# EAGLE design BergProbe (EAGLE 6.5.0)
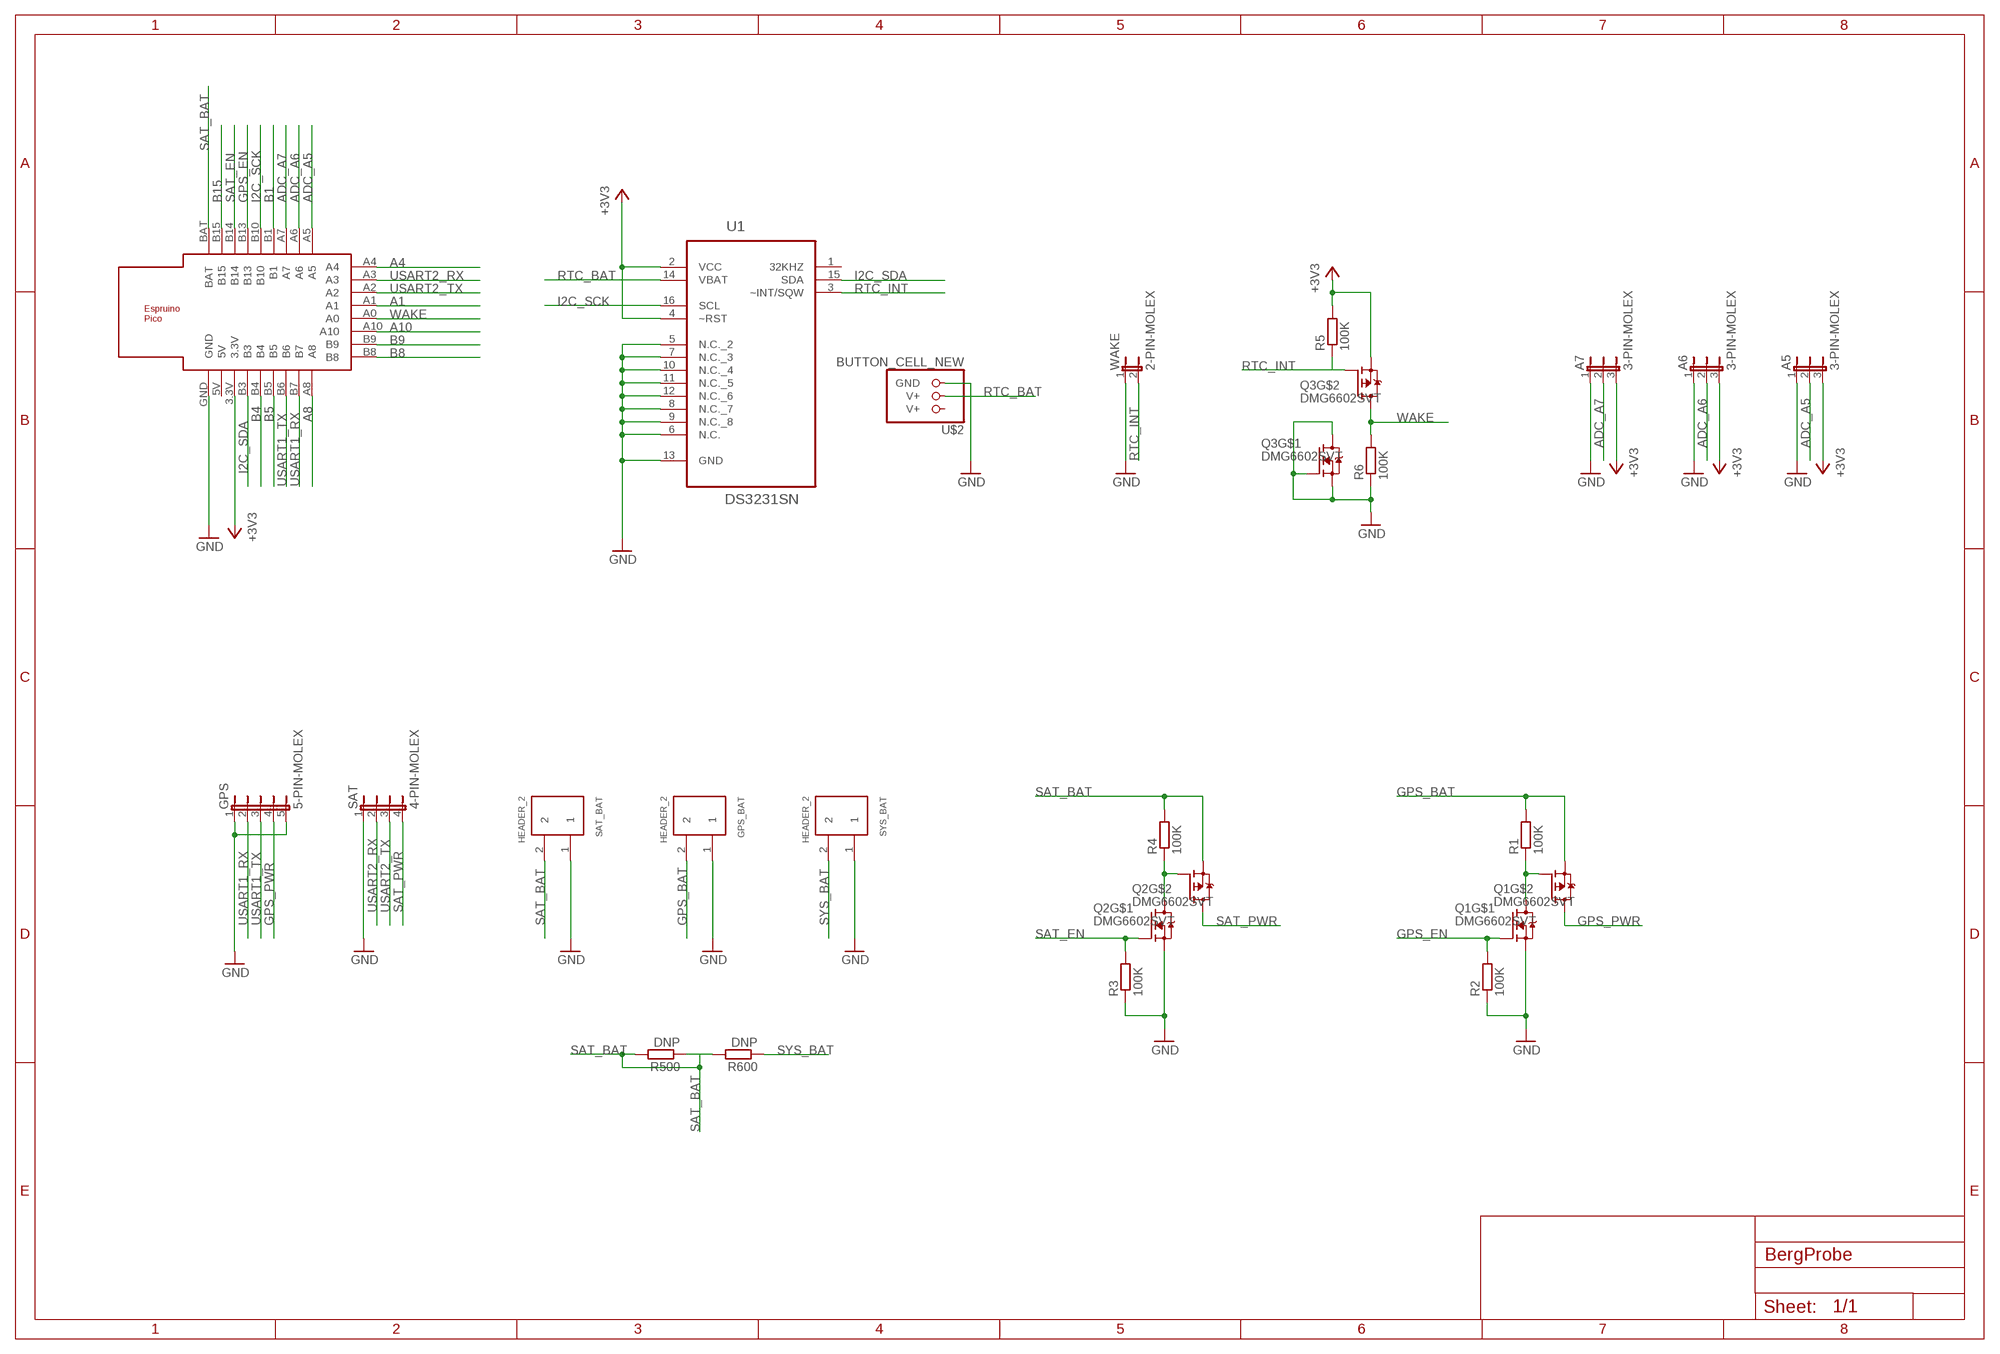
[diagram p0: schematic, sheet 1]

## Parts
A5  3-PIN-MOLEX  [3-MOLEX]
A6  3-PIN-MOLEX  [3-MOLEX]
A7  3-PIN-MOLEX  [3-MOLEX]
GPS  5-PIN-MOLEX  [5-MOLEX]
GPS_BAT  HEADER_2  [LUMBERG_CAGE_2]
Q1  DMG6602SVT  [TSOT26]
Q2  DMG6602SVT  [TSOT26]
Q3  DMG6602SVT  [TSOT26]
R1  100K  R-EU_R0805  [R0805]
R2  100K  R-EU_R0805  [R0805]
R3  100K  R-EU_R0805  [R0805]
R4  100K  R-EU_R0805  [R0805]
R5  100K  R-EU_R0805  [R0805]
R6  100K  R-EU_R0805  [R0805]
R500  DNP  R-EU_R0805  [R0805]
R600  DNP  R-EU_R0805  [R0805]
SAT  4-PIN-MOLEX  [4-MOLEX]
SAT_BAT  HEADER_2  [LUMBERG_CAGE_2]
SYS_BAT  HEADER_2  [LUMBERG_CAGE_2]
U1  DS3231SN  [SOIC127P1032X265-16N]
U$1  ESPRUINO_PICO_SMDONLY  [ESPRUINO_PICO_SMDONLY]
U$2  BUTTON_CELL_NEW  [CR2016]
WAKE  2-PIN-MOLEX  [2-MOLEX]

## Nets
+3V3: A5.3 A6.3 A7.3 Q3.P$2(S) R5.2 U1.2(VCC) U1.4(~RST) U$1.3.3V
A1: U$1.A1
A4: U$1.A4
A8: U$1.A8
A10: U$1.A10
ADC_A5: A5.2 U$1.A5
ADC_A6: A6.2 U$1.A6
ADC_A7: A7.2 U$1.A7
B1: U$1.B1
B4: U$1.B4
B5: U$1.B5
B8: U$1.B8
B9: U$1.B9
B15: U$1.B15
GND: A5.1 A6.1 A7.1 GPS.1 GPS.5 GPS_BAT.1 Q1.P$5(S) Q2.P$5(S) Q3.P$1(G) Q3.P$5(S) Q3.P$6(D) R2.1 R3.1 R6.1 SAT.1 SAT_BAT.1 SYS_BAT.1 U1.5(N.C._2) U1.6(N.C.) U1.7(N.C._3) U1.8(N.C._7) U1.9(N.C._8) U1.10(N.C._4) U1.11(N.C._5) U1.12(N.C._6) U1.13(GND) U$1.GND U$2.GND WAKE.1
GPS_BAT: GPS_BAT.2 Q1.P$2(S) R1.2
GPS_EN: Q1.P$1(G) R2.2 U$1.B13
GPS_PWR: GPS.4 Q1.P$4(D)
I2C_SCK: U1.16(SCL) U$1.B10
I2C_SDA: U1.15(SDA) U$1.B3
N$2: Q1.P$3(G) Q1.P$6(D) R1.1
N$7: Q2.P$3(G) Q2.P$6(D) R4.1
RTC_BAT: U1.14(VBAT) U$2.V+@2(V+)
RTC_INT: Q3.P$3(G) R5.1 U1.3(~INT/SQW) WAKE.2
SAT_BAT: Q2.P$2(S) R4.2 R500.1 R500.2 R600.2 SAT_BAT.2 U$1.BAT
SAT_EN: Q2.P$1(G) R3.2 U$1.B14
SAT_PWR: Q2.P$4(D) SAT.4
SYS_BAT: R600.1 SYS_BAT.2
USART1_RX: GPS.2 U$1.B7
USART1_TX: GPS.3 U$1.B6
USART2_RX: SAT.2 U$1.A3
USART2_TX: SAT.3 U$1.A2
WAKE: Q3.P$4(D) R6.2 U$1.A0
Unconnected: U1.1(32KHZ) U$1.5V U$2.V+@1(V+)

## Library data of the parts
A5-A7 = farnell-parts:3-PIN-MOLEX
GPS = farnell-parts:5-PIN-MOLEX
GPS_BAT SAT_BAT SYS_BAT = gumsense:HEADER_2
Q1-Q3 = farnell-parts:DMG6602SVT
R1-R6 R500 R600 = resistor:R-EU_: RESISTOR, European symbol
SAT = farnell-parts:4-PIN-MOLEX
U1 = farnell-parts:DS3231SN: Extremely Accurate I2C-Integrated RTC/TCXO/Crystal; MPN: DS3231SN#; OC_FARNELL: 1593292; OC_NEWARK: 68K3406; PACKAGE: SOIC-16; SUPPLIER: Maxim
U$1 = espruino_pico:ESPRUINO_PICO_SMDONLY
U$2 = gumsense:BUTTON_CELL_NEW
WAKE = farnell-parts:2-PIN-MOLEX

## Board
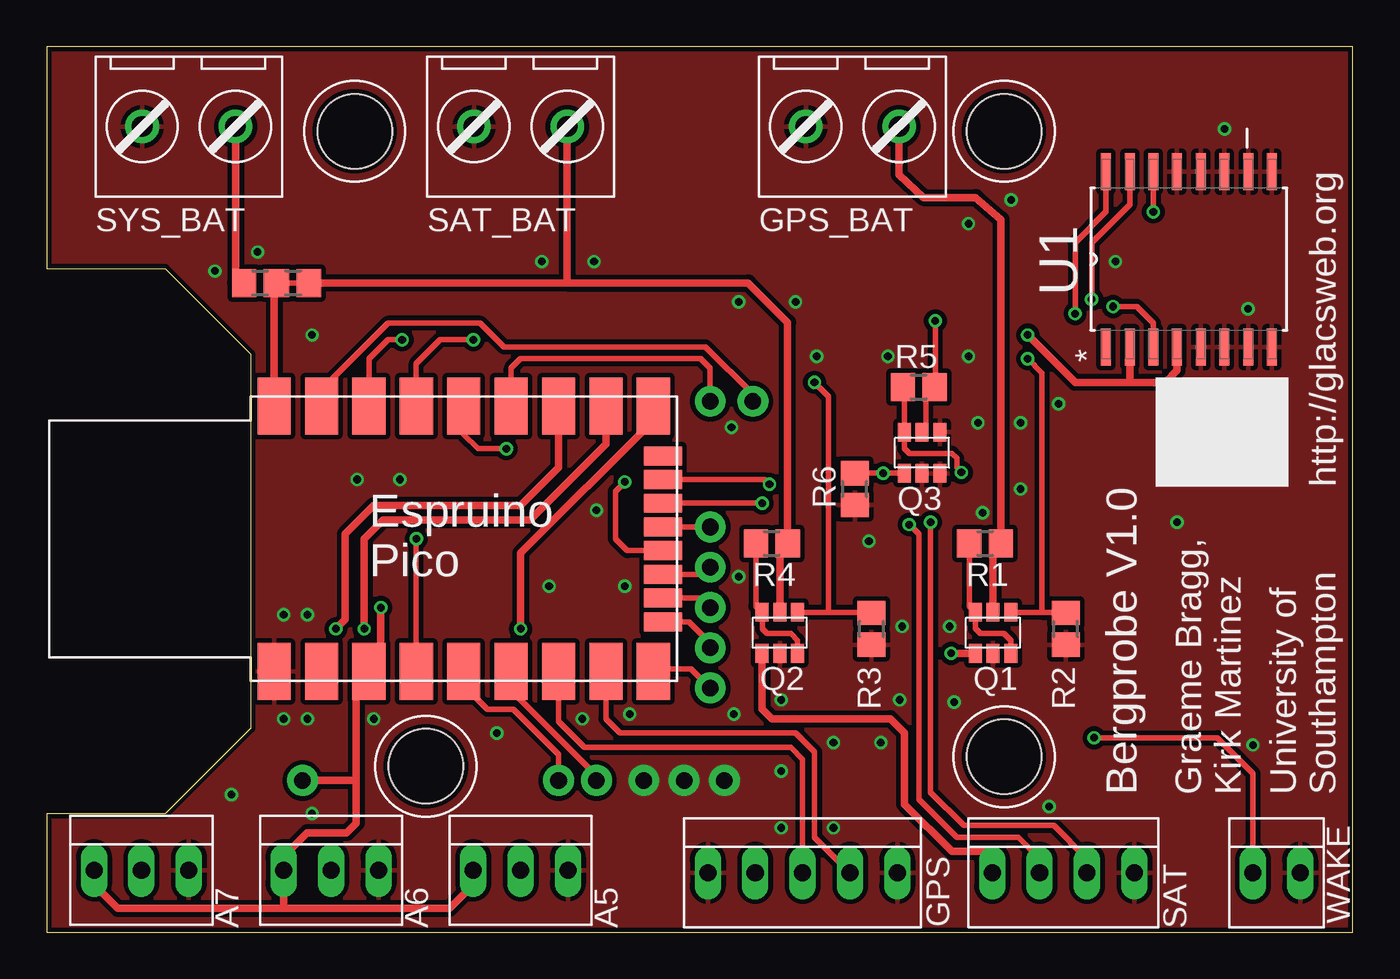
[diagram p1: board, top side]
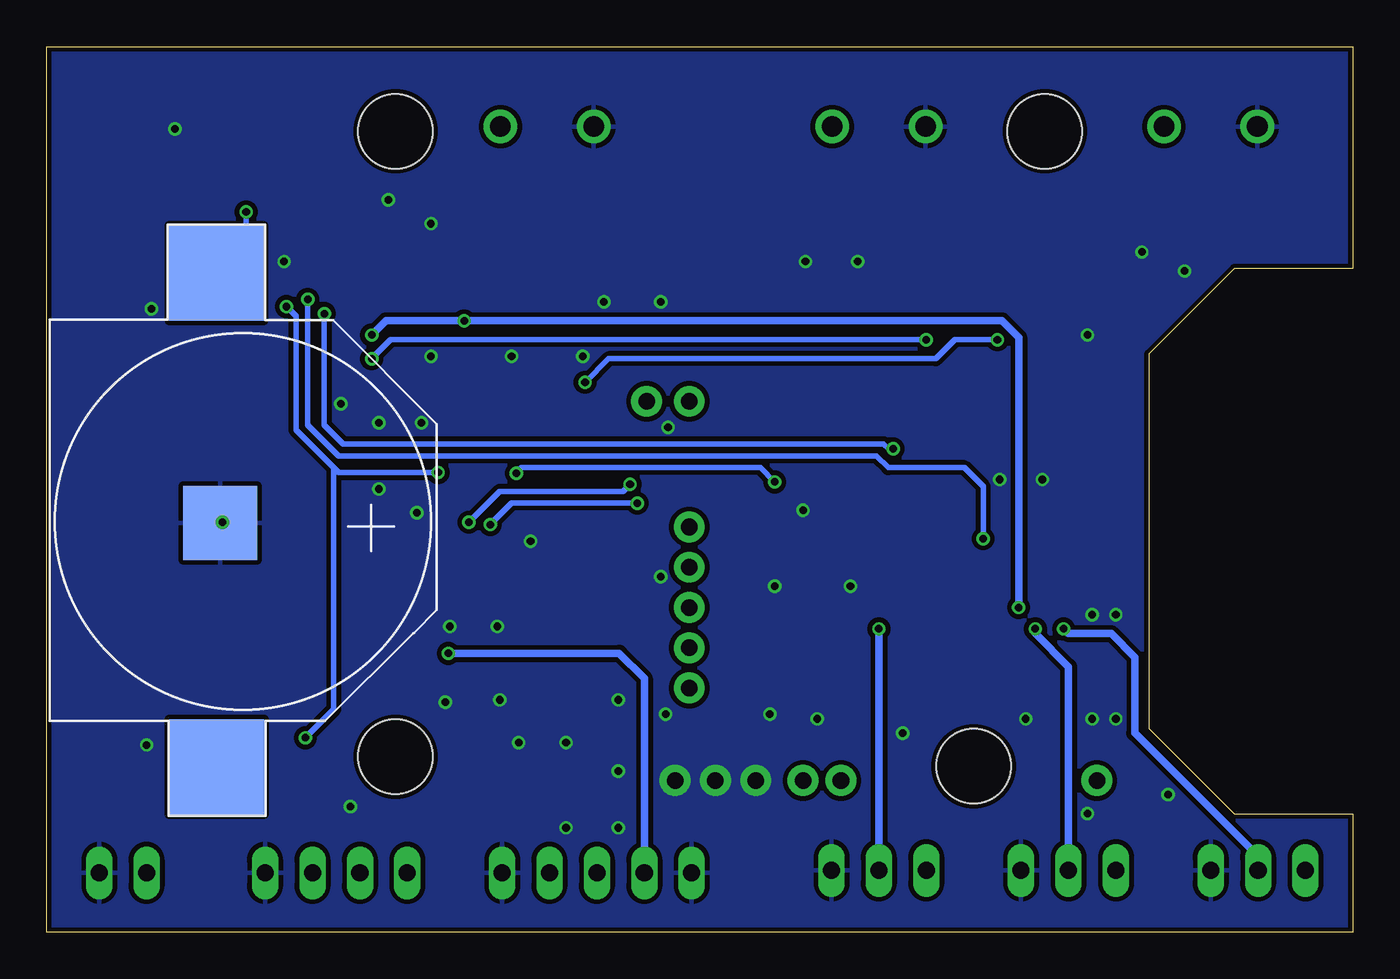
[diagram p2: board, bottom side, seen from below]

Size 70 x 47.46 mm. Coordinates in mm from the lower left corner, seen from the top.
Outline: 0,0 70,0 70,47.46 0,47.46 0,35.56 6.35,35.56 10.92,30.99 10.92,10.92 6.35,6.35 0,6.35 0,0
Copper layers (1*16): Top 0.035mm / dielectric 1.5mm / Bottom 0.035mm
Design rules "dirt_cheap_dirty_boards.v1": minimum track width 5mil, minimum drill 12mil, track to track 5mil, track to pad 5mil, pad to pad 5mil, via to via 5mil, smd to smd 0mil, copper to edge 10mil, drill to drill 10mil, minimum pad ring 10mil, minimum via ring 6mil, stop-mask expansion 2mil, vias tented up to drill 25mil, thermal gap 10mil
Holes 4 mm at 16.51,42.93 20.32,8.89 51.31,9.4 51.31,42.93
vRestrict: area 20.6,15.5 to 24.1,26.7; area 10.9,18.3 to 18.3,23.6; area 10.9,24.9 to 20.3,26.7; area 10.9,15.5 to 14.7,18.3; area 26.4,15.5 to 31.5,17.3; area 24.1,22.9 to 28.4,25.7

### Footprints (pad centres in the part's own frame; a part is rotated, then mirrored left to right if it is on the bottom)
3-MOLEX = drill 0.914 long: 1 -2.54,0; 2 0,0; 3 2.54,0
5-MOLEX = drill 0.914 long: 1 -3.937,-0.127; 2 -1.397,-0.127; 3 1.143,-0.127; 4 3.683,-0.127; 5 6.223,-0.127
LUMBERG_CAGE_2 = drill 1.1 pad 1.8: 1 -2.5,0; 2 2.5,0
TSOT26 = smd 0.7 x 1: P$1 0.4,-1.9; P$2 1.35,-1.9; P$3 2.3,-1.9; P$4 2.3,0.3; P$5 1.35,0.3; P$6 0.4,0.3
R0805 = smd 1.3 x 1.5: 1 -0.85,0; 2 0.85,0
4-MOLEX = drill 0.914 long: 1 -2.667,-0.381; 2 -0.127,-0.381; 3 2.413,-0.381; 4 4.953,-0.381
SOIC127P1032X265-16N = smd 1.981 x 0.533: 1 -4.699,4.445; 2 -4.699,3.175; 3 -4.699,1.905; 4 -4.699,0.635; 5 -4.699,-0.635; 6 -4.699,-1.905; 7 -4.699,-3.175; 8 -4.699,-4.445; 9 4.699,-4.445; 10 4.699,-3.175; 11 4.699,-1.905; 12 4.699,-0.635; 13 4.699,0.635; 14 4.699,1.905; 15 4.699,3.175; 16 4.699,4.445
ESPRUINO_PICO_SMDONLY = smd 1.778 x 3.048: 3.3V -8.89,-7.112; 5V -11.43,-7.112; A5 6.35,7.112; A6 3.81,7.112; A7 1.27,7.112; A8 6.35,-7.112; B1 -1.27,7.112; B3 -6.35,-7.112; B4 -3.81,-7.112; B5 -1.27,-7.112; B6 1.27,-7.112; B7 3.81,-7.112; B10 -3.81,7.112; B13 -6.35,7.112; B14 -8.89,7.112; B15 -11.43,7.112; BAT -13.97,7.112; GND -13.97,-7.112 | smd 2.032 x 1.016: A0 6.858,-0.635; A1 6.858,0.635; A2 6.858,1.905; A3 6.858,3.175; A4 6.858,4.445; A10 6.858,-1.905; B8 6.858,-4.445; B9 6.858,-3.175
CR2016 = smd 3.962 x 3.962: GND -1.7,8.63 | smd 5.08 x 5.08: V+@1 -14.765,8.812; V+@2 11.7,8.83
2-MOLEX = drill 0.914 long: 1 -1.27,-0.381; 2 1.27,-0.381

### Placement (x,y rotation side)
A5  25.4,3.3 180 top
A6  15.24,3.3 180 top
A7  5.08,3.3 180 top
GPS  41.66,3.05 180 top
GPS_BAT  43.18,43.18 0 top
Q1  52.07,15.24 180 top
Q2  40.64,15.24 180 top
Q3  48.26,24.89 180 top
R1  50.29,20.83 0 top
R2  54.61,16.26 90 top
R3  44.2,16.26 90 top
R4  38.86,20.83 0 top
R5  46.74,29.21 0 top
R6  43.31,23.75 90 top
R500  13.21,34.8 0 top
R600  11.43,34.8 0 top
SAT  55.63,2.79 180 top
SAT_BAT  25.4,43.18 0 top
SYS_BAT  7.62,43.18 0 top
U1  61.21,36.07 90 top
U$1  26.16,21.08 0 top
U$2  52.07,23.62 90 bottom
WAKE  65.91,2.79 180 top

### Tracks (layer width: path | path; a pad name or v marks a point on that pad's centre or on a via)
+3V3  (via drill 0.41, 0.89 pad 1.65)
  Top 0.305: Q3.P$2 46.91,26.84 47.12,27.05 47.12,28.74 R5.2 47.62,29.25 v47.62,32.77
  Top 0.406: A7.3 2.54,2.54 3.81,1.27 12.7,1.27 | 12.7,1.27 21.59,1.27 22.86,2.54 A5.3 | 12.7,1.27 A6.3 12.7,4.06 13.97,5.33 16.08,5.33 16.59,5.84 16.59,8.13 | 16.59,8.13 16.59,13.34 U$1.3.3V 17.91,14.61 v17.91,17.4 | U1.2 58.04,29.59 58.17,29.46 | U1.4 60.58,30.1 59.94,29.46 58.17,29.46 | 58.17,29.46 55.12,29.46 v52.58,32 | v13.72,8.13 16.59,8.13
  Bottom 0.406: v52.58,32 51.82,32.77 v47.62,32.77 47.5,32.77 18.8,32.77 17.91,31.88 v17.91,17.4
A1  (via drill 0.89 pad 1.65)
  Top 0.305: v35.56,21.72 U$1.A1
A8  (via drill 0.89 pad 1.65)
  Top 0.305: U$1.A8 32.64,14.1 34.54,14.1 v35.56,13.08
A10  (via drill 0.89 pad 1.65)
  Top 0.305: U$1.A10 35.18,19.18 v35.56,19.56
ADC_A5  (via drill 0.41)
  Top 0.406: U$1.A5 32.51,27.43 25.4,20.32 v25.4,16.26
  Bottom 0.406: v25.4,16.26 A5.2
ADC_A6  (via drill 0.41)
  Top 0.406: U$1.A6 29.97,26.16 25.91,22.1 18.03,22.1 17.02,21.08 v17.02,16.26
  Bottom 0.406: v17.02,16.26 17.02,16 15.24,14.22 A6.2
ADC_A7  (via drill 0.41)
  Top 0.406: U$1.A7 27.43,24.89 25.4,22.86 17.53,22.86 16,21.34 16,16.76 v15.49,16.26
  Bottom 0.406: v15.49,16.26 15.24,16 12.95,16 11.68,14.73 11.68,10.67 5.08,4.06 A7.2
B1  (via drill 0.89 pad 1.65)
  Top 0.305: U$1.B1 24.89,30.23 25.4,30.73 35.05,30.73 35.56,30.23 v35.56,28.45
B4  (via drill 0.89 pad 1.65)
  Top 0.305: v27.43,8.13 27.43,9.53 25.02,11.94 23.62,11.94 22.61,12.95 22.61,13.72 U$1.B4
B5  (via drill 0.89 pad 1.65)
  Top 0.305: U$1.B5 24.89,12.95 29.46,8.38 v29.46,8.13
B8  (via drill 0.89 pad 1.65)
  Top 0.305: U$1.B8 34.42,16.64 35.56,15.49 v35.56,15.24
B9  (via drill 0.89 pad 1.65)
  Top 0.305: U$1.B9 35.05,17.91 v35.56,17.4
B15  (via drill 0.89 pad 1.65)
  Top 0.305: v37.85,28.45 37.85,28.83 35.31,31.37 24.51,31.37 23.24,32.64 18.29,32.64 14.73,29.08 U$1.B15
GND  (via drill 0.41, 0.89 pad 1.65)
  other vias: 32,8.13 34.16,8.13 36.32,8.13 26.92,18.54 30.99,18.54 29.46,22.61 14.22,32 12.7,11.43 13.97,11.43 12.7,17.02 13.97,17.02 24.13,10.67 39.37,8.64 39.37,5.59 42.16,10.16 44.7,10.16 42.16,5.59 45.72,12.45 39.37,12.45 36.83,11.68 37.08,19.05 31.24,11.68 28.7,11.43 36.7,27.05 18.92,24.26 16.64,24.26 26.54,35.94 29.34,35.94 11.3,36.45 9.02,35.43 37.08,33.78 40.13,33.78 54.23,28.32 52.2,27.3 52.2,23.75 49.91,27.3 50.16,22.48 44.07,20.95 41.27,30.86 49.4,37.97 51.69,39.24 57.28,35.94 60.58,21.97 53.72,6.73 48.64,12.32 63.12,43.05 64.39,33.4 9.91,7.37 14.22,6.35 17.53,11.43 64.64,10.03 49.4,30.86 45.09,30.86 48.39,16.38 45.85,16.38
  pour Top (isolate 0.254): -7.87,52.58 -7.87,-5.33 104.65,-5.33 104.65,52.58
  pour Bottom (isolate 0.254): -7.11,51.82 -7.11,-6.1 105.41,-6.1 105.41,51.82
GPS_BAT
  Top 0.406: Q1.P$2 50.72,20.41 R1.2 51.14,38.19 49.78,39.37 46.99,39.37 45.68,40.6 GPS_BAT.2
GPS_EN  (via drill 0.41)
  Top 0.305: 53.34,17.14 Q1.P$1 | U$1.B13 19.81,30.48 21.08,31.75 v22.86,31.75 | v52.58,30.73 53.34,29.97 53.34,17.14 | 53.34,17.14 54.61,17.14 R2.2
  Bottom 0.305: v22.86,31.75 51.56,31.75 v52.58,30.73
GPS_PWR  (via drill 0.41)
  Top 0.406: Q1.P$4 v48.47,14.94
  Bottom 0.406: v48.47,14.94 39.32,14.94 37.97,13.59 GPS.4
I2C_SCK  (via drill 0.41)
  Top 0.305: U$1.B10 22.35,26.67 23.11,25.91 v24.64,25.91 | U1.16 56.77,38.61 55.12,36.96 v55.12,33.15
  Bottom 0.305: v24.64,25.91 24.89,25.91 25.15,26.16 54.1,26.16 55.12,27.18 v55.12,33.15
I2C_SDA  (via drill 0.41)
  Top 0.305: U$1.B3 v19.81,21.08 | U1.15 58.04,38.99 56.01,36.96 v56.01,33.91
  Bottom 0.305: v19.81,21.08 19.81,23.88 20.83,24.89 24.89,24.89 25.53,25.53 54.36,25.53 56.01,27.18 v56.01,33.91
N$2
  Top 0.305: R1.1 49.44,17.47 Q1.P$3 49.77,16.27 50.04,16 51.31,16 51.67,15.64 Q1.P$6
N$7
  Top 0.305: R4.1 38.01,17.47 Q2.P$3 38.35,17.13 38.35,16.26 38.61,16 39.88,16 40.24,15.64 Q2.P$6
RTC_BAT  (via drill 0.41)
  Top 0.305: U1.14 v59.31,38.61
  Bottom 0.305: U$2.V+@2 59.31,36.91 v59.31,38.61
RTC_INT  (via drill 0.41)
  Top 0.305: U1.3 59.31,32.64 58.42,33.53 v57.15,33.53 | v56.13,10.41 62.74,10.41 64.64,8.51 WAKE.2 | v49.02,24.64 48.77,24.89 48.77,25.4 48.51,25.65 46.23,25.65 45.96,25.92 Q3.P$3 45.96,29.14 R5.1
  Bottom 0.305: 54.61,24.89 56.64,26.92 56.64,33.02 v57.15,33.53 | 54.61,24.89 54.61,11.94 v56.13,10.41 | 54.61,24.89 54.36,24.64 v49.02,24.64
SAT_BAT
  Top 0.305: R500.2 R500.1
  Top 0.406: SAT_BAT.2 27.9,34.8 | 27.9,34.8 R500.2 | U$1.BAT 12.19,34.71 R600.2 R500.1 | Q2.P$2 39.29,20.41 R4.2 39.71,32.68 37.59,34.8 27.9,34.8
SAT_EN  (via drill 0.41)
  Top 0.305: R3.2 44.16,17.14 41.91,17.14 | 41.91,17.14 Q2.P$1 | v41.15,29.46 41.91,28.7 41.91,17.14 | U$1.B14 17.27,30.73 18.29,31.75 v19.05,31.75
  Top 0.406: 40.27,17.11 Q2.P$1
  Bottom 0.305: v19.05,31.75 21.34,31.75 22.35,30.73 39.88,30.73 v41.15,29.46
SAT_PWR
  Top 0.406: Q2.P$4 38.34,11.95 38.86,11.43 45.21,11.43 45.97,10.67 45.97,6.86 48.51,4.32 50.55,4.32 50.67,4.19 SAT.4
SYS_BAT
  Top 0.406: SYS_BAT.2 10.12,34.8 R600.1
USART1_RX
  Top 0.305: U$1.B7 29.97,11.43 30.73,10.67 40.13,10.67 41.15,9.65 41.15,5.08 GPS.2
USART1_TX
  Top 0.305: U$1.B6 27.43,11.3 28.83,9.91 39.88,9.91 40.51,9.27 GPS.3
USART2_RX  (via drill 0.41)
  Top 0.305: U$1.A3 38.48,24.26 v38.73,24 | SAT.2 55.75,3.94 53.98,5.71 49.15,5.71 47.37,7.49 v47.37,21.97
  Bottom 0.305: v38.73,24 39.12,23.62 45.72,23.62 v47.37,21.97
USART2_TX  (via drill 0.41)
  Top 0.305: U$1.A2 v38.35,22.99 | v46.23,21.84 46.74,21.34 46.74,7.11 48.77,5.08 52.07,5.08 53.21,3.94 SAT.3
  Bottom 0.305: v38.35,22.99 45.09,22.99 v46.23,21.84
WAKE  (via drill 0.41)
  Top 0.305: U$1.A0 31.11,20.45 30.48,21.08 30.48,23.62 v30.99,24.13 | Q3.P$4 v44.83,24.6 R6.2
  Bottom 0.305: v30.99,24.13 31.75,24.89 44.54,24.89 v44.83,24.6

### Text on the board
tPlace: http://glacsweb.org | Bergprobe V1.0 | Graeme Bragg, / Kirk Martinez | University of / Southampton
tNames: Espruino / Pico